# EAGLE schematic AIO (EAGLE 6.4)
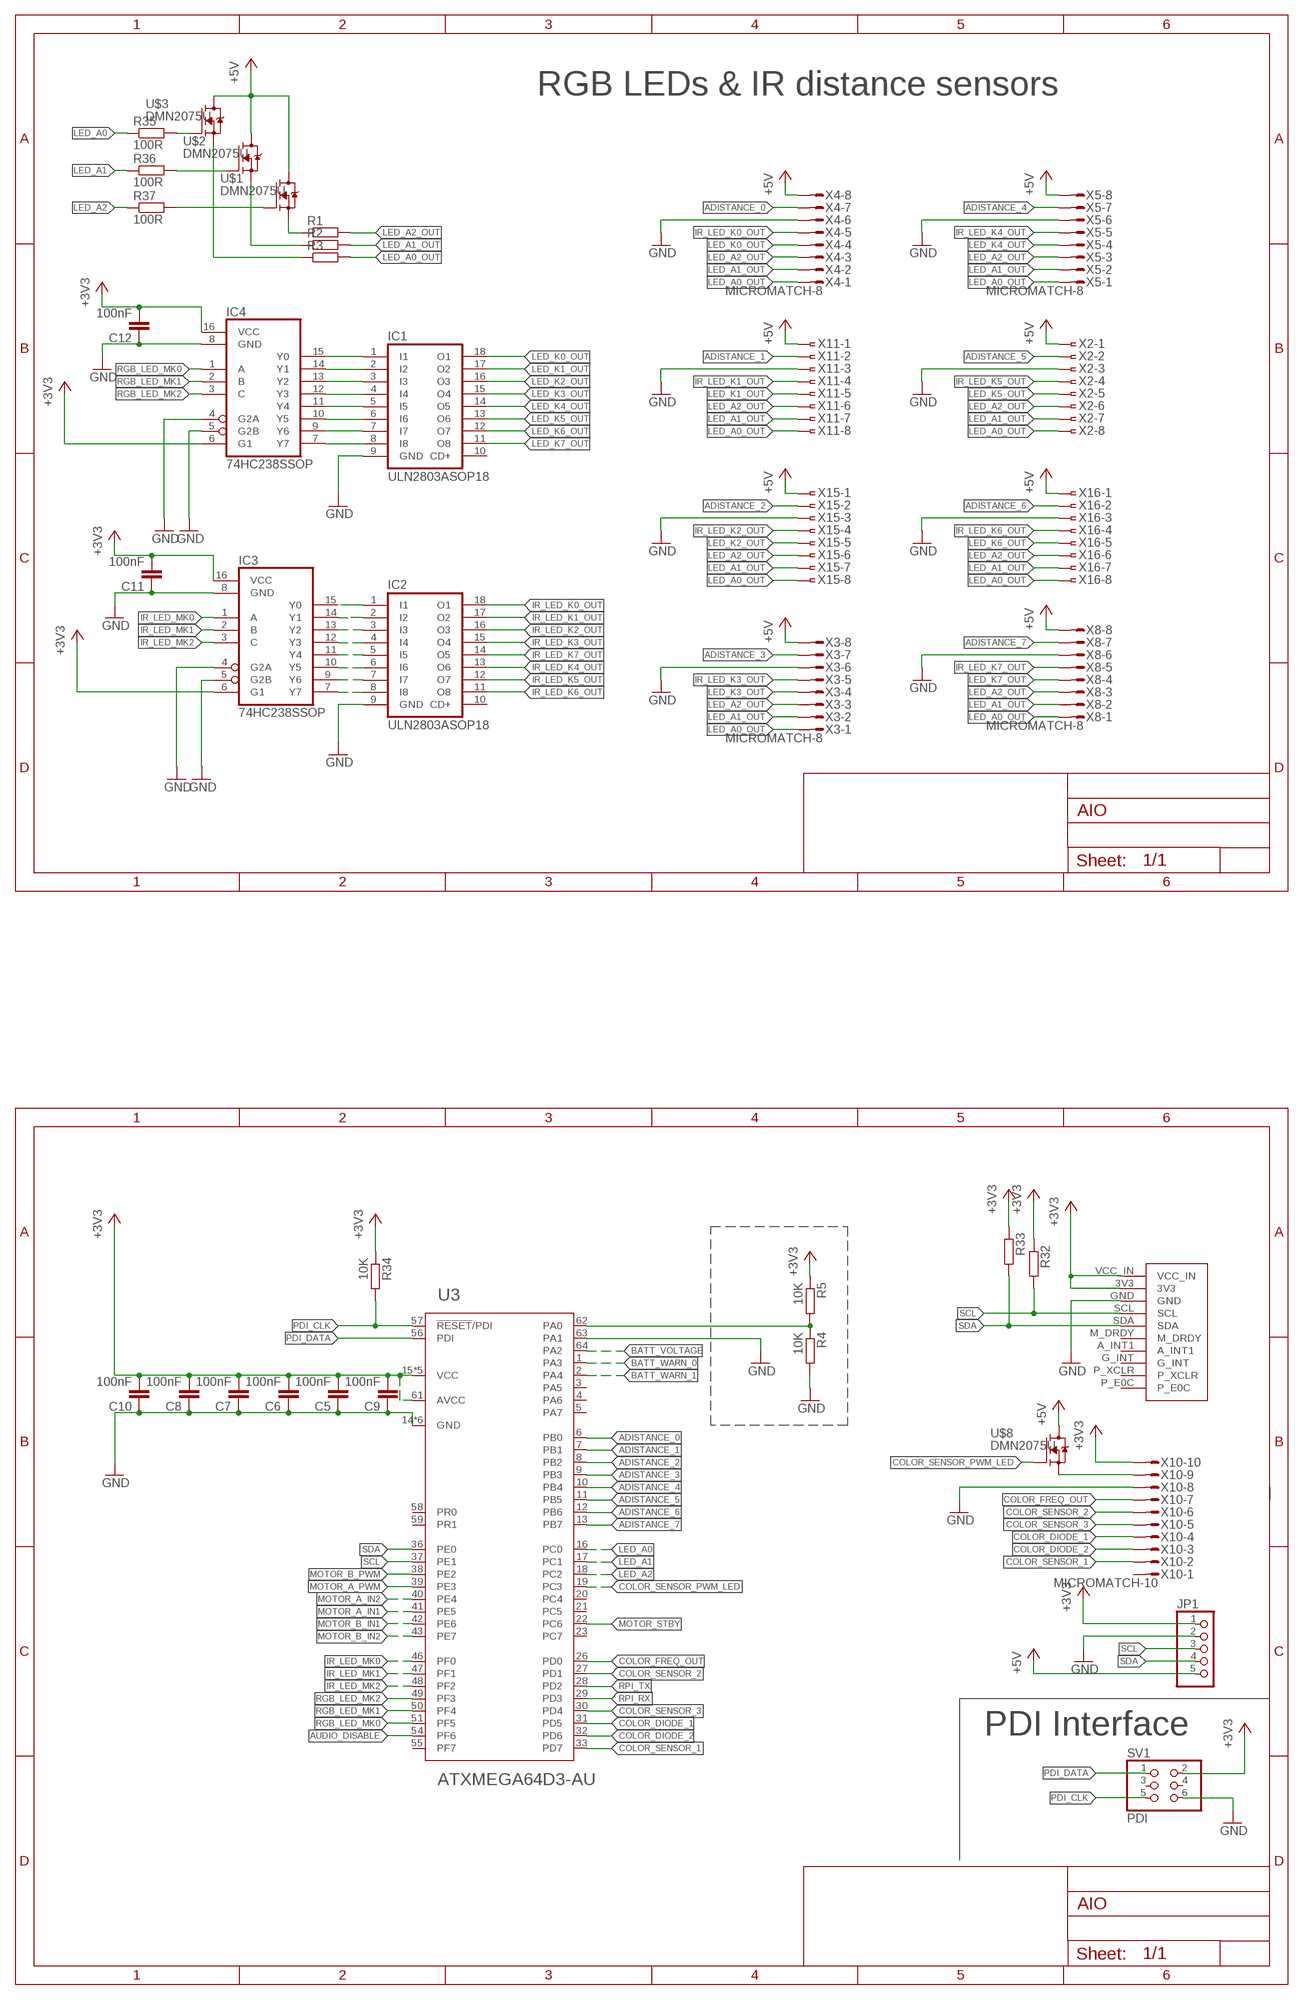
[diagram p0: schematic, sheet 1, part 1 of 2]
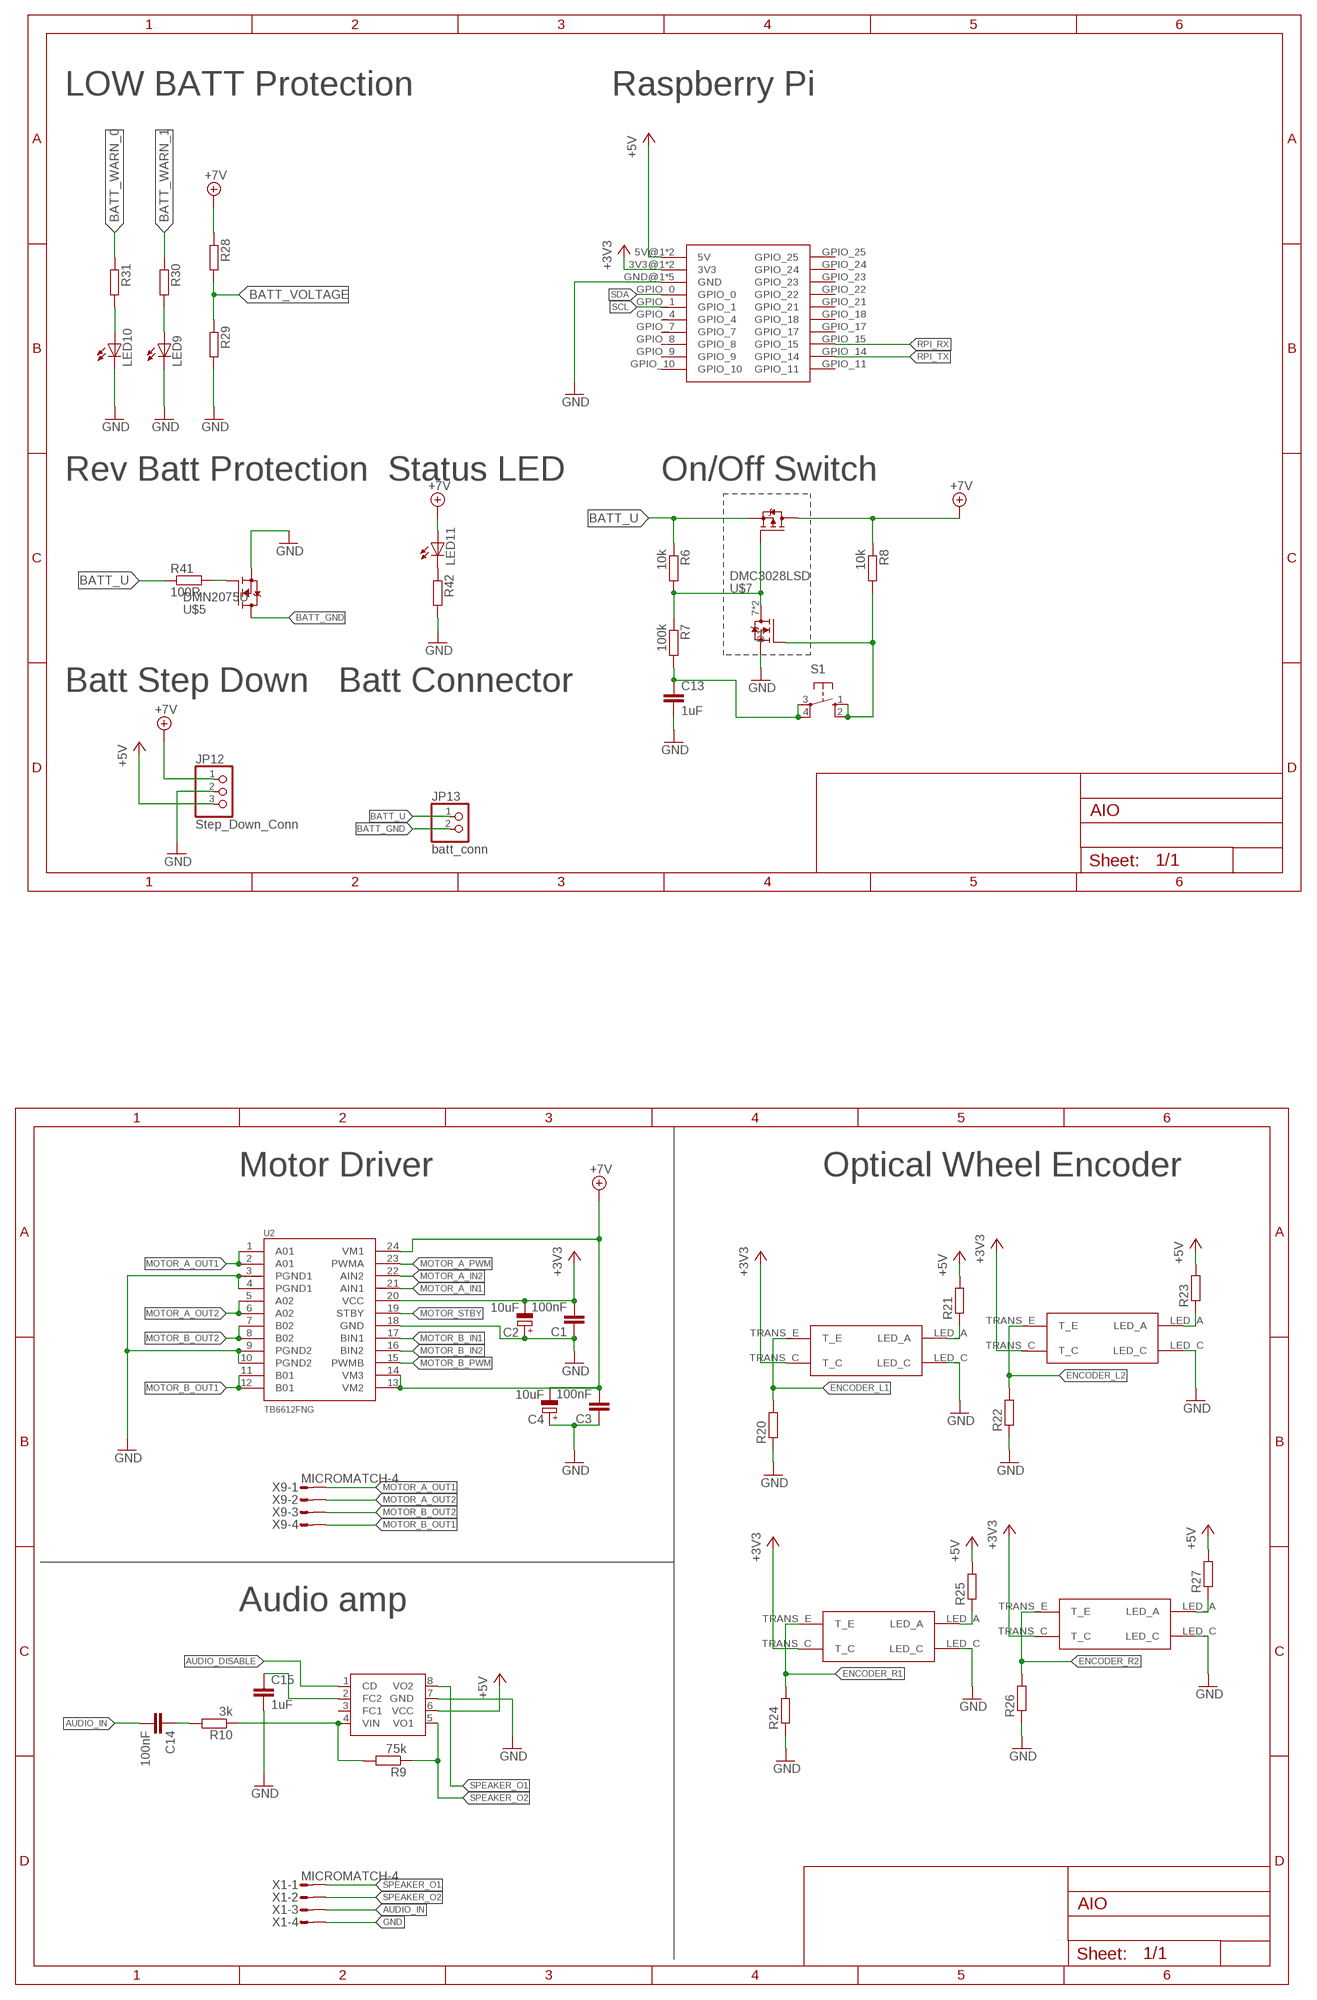
[diagram p1: schematic, sheet 1, part 2 of 2]

## Parts
C1  100nF  C-EUC0603  [C0603]
C2  10uF  CPOL-EUSMCD  [SMC_D]
C3  100nF  C-EUC0603  [C0603]
C4  10uF  CPOL-EUSMCD  [SMC_D]
C5  100nF  C-EUC0603  [C0603]
C6  100nF  C-EUC0603  [C0603]
C7  100nF  C-EUC0603  [C0603]
C8  100nF  C-EUC0603  [C0603]
C9  100nF  C-EUC0603  [C0603]
C10  100nF  C-EUC0603  [C0603]
C11  100nF  C-EUC0603  [C0603]
C12  100nF  C-EUC0603  [C0603]
C13  1uF  C-EUC0603  [C0603]
C14  100nF  C-EUC0603  [C0603]
C15  1uF  C-EUC0603  [C0603]
IC1  ULN2803ASOP18  [SOP18]
IC2  ULN2803ASOP18  [SOP18]
IC3  74HC238SSOP  [SSOP16]
IC4  74HC238SSOP  [SSOP16]
IC5  TS34119SMD  [SO08]
JP1  PINHD-1X5  [1X05]
JP12  Step_Down_Conn  PINHD-1X3  [1X03]
JP13  batt_conn  PINHD-1X2  [1X02]
LED9  LEDCHIPLED_0603  [CHIPLED_0603]
LED10  LEDCHIPLED_0603  [CHIPLED_0603]
LED11  LEDCHIPLED_0603  [CHIPLED_0603]
R1  R-EU_R0603  [R0603]
R2  R-EU_R0603  [R0603]
R3  R-EU_R0603  [R0603]
R4  10K  R-EU_R0603  [R0603]
R5  10K  R-EU_R0603  [R0603]
R6  10k  R-EU_R0603  [R0603]
R7  100k  R-EU_R0603  [R0603]
R8  10k  R-EU_R0603  [R0603]
R9  75k  R-EU_R0603  [R0603]
R10  3k  R-EU_R0603  [R0603]
R20  R-EU_R0603  [R0603]
R21  R-EU_R0603  [R0603]
R22  R-EU_R0603  [R0603]
R23  R-EU_R0603  [R0603]
R24  R-EU_R0603  [R0603]
R25  R-EU_R0603  [R0603]
R26  R-EU_R0603  [R0603]
R27  R-EU_R0603  [R0603]
R28  R-EU_R0603  [R0603]
R29  R-EU_R0603  [R0603]
R30  R-EU_R0603  [R0603]
R31  R-EU_R0603  [R0603]
R32  R-EU_R0603  [R0603]
R33  R-EU_R0603  [R0603]
R34  10K  R-EU_R0603  [R0603]
R35  100R  R-EU_R0603  [R0603]
R36  100R  R-EU_R0603  [R0603]
R37  100R  R-EU_R0603  [R0603]
R41  100R  R-EU_R0603  [R0603]
R42  R-EU_R0603  [R0603]
S1  10-XX  [B3F-10XX]
SV1  PDI  PINHD-2X3  [2X03]
U2  TB6612FNG  TB6621FNG  [SSOP24]
U3  ATXMEGA64D3-AU  [TQFP-64A-64]
U$1  DMN2075U  [SOT95P240X112-3N]
U$2  DMN2075U  [SOT95P240X112-3N]
U$3  DMN2075U  [SOT95P240X112-3N]
U$5  DMN2075U  [SOT95P240X112-3N]
U$7  DMC3028LSD  [SO08]
U$8  DMN2075U  [SOT95P240X112-3N]
U$21  CNY70  [CNY70]
U$22  CNY70  [CNY70]
U$23  CNY70  [CNY70]
U$24  CNY70  [CNY70]
U$25  GY-81  [GY-81]
U$26  RASPBERRY-PI  [RASPERRRY-PI]
X1  MICROMATCH-4  [MICROMATCH-4]
X2  FSIDE-8  [FSIDE-8]
X3  MICROMATCH-8  [MICROMATCH-8]
X4  MICROMATCH-8  [MICROMATCH-8]
X5  MICROMATCH-8  [MICROMATCH-8]
X8  MICROMATCH-8  [MICROMATCH-8]
X9  MICROMATCH-4  [MICROMATCH-4]
X10  MICROMATCH-10  [MICROMATCH-10]
X11  FSIDE-8  [FSIDE-8]
X15  FSIDE-8  [FSIDE-8]
X16  FSIDE-8  [FSIDE-8]

## Nets
+3V3: C1.2 C2.- C5.2 C6.2 C7.2 C8.2 C9.2 C10.2 C11.2 C12.2 IC3.6(G1) IC3.16(VCC) IC4.6(G1) IC4.16(VCC) JP1.1 R5.1 R32.1 R33.1 R34.1 SV1.2 U2.20(VCC) U3.15(VCC) U3.25(VCC) U3.35(VCC) U3.45(VCC) U3.53(VCC) U3.61(AVCC) U$21.TRANS_C(T_C) U$22.TRANS_C(T_C) U$23.TRANS_C(T_C) U$24.TRANS_C(T_C) U$25.3V3 U$25.VCC_IN U$26.3V3@1(3V3) U$26.3V3@2(3V3) X10.10
+5V: IC5.6(VCC) JP1.5 JP12.3 R21.2 R23.2 R25.2 R27.2 U$1.D U$2.D U$3.D U$8.D U$26.5V@1(5V) U$26.5V@2(5V) X2.1 X3.8 X4.8 X5.8 X8.8 X11.1 X15.1 X16.1
+7V: C3.2 C4.- JP12.1 LED11.A R8.1 R28.1 U2.13(VM2) U2.14(VM3) U2.24(VM1) U$7.5(D2) U$7.6(D2)
ADISTANCE_0: U3.6(PB0) X4.7
ADISTANCE_1: U3.7(PB1) X11.2
ADISTANCE_2: U3.8(PB2) X15.2
ADISTANCE_3: U3.9(PB3) X3.7
ADISTANCE_4: U3.10(PB4) X5.7
ADISTANCE_5: U3.11(PB5) X2.2
ADISTANCE_6: U3.12(PB6) X16.2
ADISTANCE_7: U3.13(PB7) X8.7
AUDIO_DISABLE: IC5.1(CD) U3.54(PF6)
AUDIO_IN: C14.2 X1.3
BATT_GND: JP13.2 U$5.D
BATT_U: JP13.1 R6.1 R41.1 U$7.3(S2)
BATT_VOLTAGE: R28.2 R29.1 U3.64(PA2)
BATT_WARN_0: R31.1 U3.1(PA3)
BATT_WARN_1: R30.1 U3.2(PA4)
COLOR_DIODE_1: U3.31(PD5) X10.4
COLOR_DIODE_2: U3.32(PD6) X10.3
COLOR_FREQ_OUT: U3.26(PD0) X10.7
COLOR_SENSOR_1: U3.33(PD7) X10.2
COLOR_SENSOR_2: U3.27(PD1) X10.6
COLOR_SENSOR_3: U3.30(PD4) X10.5
COLOR_SENSOR_PWM_LED: U3.19(PC3) U$8.G
ENCODER_L1: R20.2 U$21.TRANS_E(T_E)
ENCODER_L2: R22.2 U$22.TRANS_E(T_E)
ENCODER_R1: R24.2 U$23.TRANS_E(T_E)
ENCODER_R2: R26.2 U$24.TRANS_E(T_E)
GND: C1.1 C2.+ C3.1 C4.+ C5.1 C6.1 C7.1 C8.1 C9.1 C10.1 C11.1 C12.1 C13.2 C15.2 IC1.9(GND) IC2.9(GND) IC3.4(G2A) IC3.5(G2B) IC3.8(GND) IC4.4(G2A) IC4.5(G2B) IC4.8(GND) IC5.7(GND) JP1.2 JP12.2 LED9.C LED10.C R4.2 R20.1 R22.1 R24.1 R26.1 R29.2 R42.2 SV1.6 U2.3(PGND1) U2.4(PGND1) U2.9(PGND2) U2.10(PGND2) U2.18(GND) U3.14(GND) U3.24(GND) U3.34(GND) U3.44(GND) U3.52(GND) U3.60(GND) U3.63(PA1) U$5.S U$7.1(S1) U$21.LED_C U$22.LED_C U$23.LED_C U$24.LED_C U$25.GND U$26.GND@1(GND) U$26.GND@2(GND) U$26.GND@3(GND) U$26.GND@4(GND) U$26.GND@5(GND) X1.4 X2.3 X3.6 X4.6 X5.6 X8.6 X10.8 X11.3 X15.3 X16.3
IR_LED_K0: IC2.1(I1) IC3.15(Y0)
IR_LED_K0_OUT: IC2.18(O1) X4.5
IR_LED_K1: IC2.2(I2) IC3.14(Y1)
IR_LED_K1_OUT: IC2.17(O2) X11.4
IR_LED_K2_OUT: IC2.16(O3) X15.4
IR_LED_K3_OUT: IC2.15(O4) X3.5
IR_LED_K4_OUT: IC2.13(O6) X5.5
IR_LED_K5_OUT: IC2.12(O7) X2.4
IR_LED_K6_OUT: IC2.11(O8) X16.4
IR_LED_K7_OUT: IC2.14(O5) X8.5
IR_LED_MK0: IC3.1(A) U3.46(PF0)
IR_LED_MK1: IC3.2(B) U3.47(PF1)
IR_LED_MK2: IC3.3(C) U3.48(PF2)
LED_A0: R35.1 U3.16(PC0)
LED_A0_OUT: R3.2 X2.8 X3.1 X4.1 X5.1 X8.1 X11.8 X15.8 X16.8
LED_A1: R36.1 U3.17(PC1)
LED_A1_OUT: R2.2 X2.7 X3.2 X4.2 X5.2 X8.2 X11.7 X15.7 X16.7
LED_A2: R37.1 U3.18(PC2)
LED_A2_OUT: R1.2 X2.6 X3.3 X4.3 X5.3 X8.3 X11.6 X15.6 X16.6
LED_K0_OUT: IC1.18(O1) X4.4
LED_K1_OUT: IC1.17(O2) X11.5
LED_K2_OUT: IC1.16(O3) X15.5
LED_K3_OUT: IC1.15(O4) X3.4
LED_K4_OUT: IC1.14(O5) X5.4
LED_K5_OUT: IC1.13(O6) X2.5
LED_K6_OUT: IC1.12(O7) X16.5
LED_K7_OUT: IC1.11(O8) X8.4
MOTOR_A_IN1: U2.21(AIN1) U3.41(PE5)
MOTOR_A_IN2: U2.22(AIN2) U3.40(PE4)
MOTOR_A_OUT1: U2.1(A01) U2.2(A01) X9.1
MOTOR_A_OUT2: U2.5(A02) U2.6(A02) X9.2
MOTOR_A_PWM: U2.23(PWMA) U3.39(PE3)
MOTOR_B_IN1: U2.17(BIN1) U3.42(PE6)
MOTOR_B_IN2: U2.16(BIN2) U3.43(PE7)
MOTOR_B_OUT1: U2.11(B01) U2.12(B01) X9.4
MOTOR_B_OUT2: U2.7(B02) U2.8(B02) X9.3
MOTOR_B_PWM: U2.15(PWMB) U3.38(PE2)
MOTOR_STBY: U2.19(STBY) U3.22(PC6)
N$1: R1.1 U$1.S
N$2: R2.1 U$2.S
N$3: R3.1 U$3.S
N$4: R4.1 R5.2 U3.62(PA0)
N$5: U$8.S X10.9
N$6: IC2.3(I3) IC3.13(Y2)
N$7: IC2.4(I4) IC3.12(Y3)
N$8: R41.2 U$5.G
N$9: IC2.5(I5) IC3.11(Y4)
N$10: IC2.6(I6) IC3.10(Y5)
N$11: R23.1 U$22.LED_A
N$12: IC2.7(I7) IC3.9(Y6)
N$13: IC2.8(I8) IC3.7(Y7)
N$15: IC5.4(VIN) R9.2 R10.1
N$16: C13.1 R7.2 S1.3(P) S1.4(P1)
N$17: C14.1 R10.2
N$18: R8.2 S1.1(S) S1.2(S1) U$7.2(G1)
N$19: LED11.C R42.1
N$20: R25.1 U$23.LED_A
N$21: IC1.1(I1) IC4.15(Y0)
N$22: R6.2 R7.1 U$7.4(G2) U$7.7(D1) U$7.8(D1)
N$23: R21.1 U$21.LED_A
N$24: IC1.2(I2) IC4.14(Y1)
N$26: R27.1 U$24.LED_A
N$27: IC1.3(I3) IC4.13(Y2)
N$28: IC1.4(I4) IC4.12(Y3)
N$29: LED9.A R30.2
N$30: IC1.5(I5) IC4.11(Y4)
N$31: IC1.6(I6) IC4.10(Y5)
N$32: LED10.A R31.2
N$33: IC1.7(I7) IC4.9(Y6)
N$34: IC1.8(I8) IC4.7(Y7)
N$36: C15.1 IC5.2(FC2)
N$38: R35.2 U$3.G
N$39: R36.2 U$2.G
N$40: R37.2 U$1.G
PDI_CLK: R34.2 SV1.5 U3.57(!RESET!/PDI)
PDI_DATA: SV1.1 U3.56(PDI)
RGB_LED_MK0: IC4.1(A) U3.51(PF5)
RGB_LED_MK1: IC4.2(B) U3.50(PF4)
RGB_LED_MK2: IC4.3(C) U3.49(PF3)
RPI_RX: U3.29(PD3) U$26.GPIO_15
RPI_TX: U3.28(PD2) U$26.GPIO_14
SCL: JP1.3 R32.2 U3.37(PE1) U$25.SCL U$26.GPIO_1
SDA: JP1.4 R33.2 U3.36(PE0) U$25.SDA U$26.GPIO_0
SPEAKER_O1: IC5.8(VO2) X1.1
SPEAKER_O2: IC5.5(VO1) R9.1 X1.2
Unconnected: IC1.10(CD+) IC2.10(CD+) IC5.3(FC1) SV1.3 SV1.4 U3.3(PA5) U3.4(PA6) U3.5(PA7) U3.20(PC4) U3.21(PC5) U3.23(PC7) U3.55(PF7) U3.58(PR0) U3.59(PR1) U$25.A_INT1 U$25.G_INT U$25.M_DRDY U$25.P_E0C U$25.P_XCLR U$26.GPIO_4 U$26.GPIO_7 U$26.GPIO_8 U$26.GPIO_9 U$26.GPIO_10 U$26.GPIO_11 U$26.GPIO_17 U$26.GPIO_18 U$26.GPIO_21 U$26.GPIO_22 U$26.GPIO_23 U$26.GPIO_24 U$26.GPIO_25 X10.1

## Notes on the sheet
- RGB LEDs & IR distance sensors | LOW BATT Protection | Raspberry Pi
- Rev Batt Protection | Status LED | On/Off Switch
- Batt Step Down | Batt Connector
- Motor Driver | Optical Wheel Encoder
- Audio amp
- PDI Interface

## Library data of the parts
C1 C3 C5-C15 = rcl:C-EU: CAPACITOR, European symbol
C2 C4 = rcl:CPOL-EU: POLARIZED CAPACITOR, European symbol
IC1 IC2 = BEEP:ULN2803A: DRIVER ARRAY
IC3 IC4 = BEEP:74HC238: 3 to 8 line DECODER/DEMULTIPLEXER
IC5 = BEEP:TS34119
JP1 = pinhead:PINHD-1X5: PIN HEADER
JP12 = pinhead:PINHD-1X3: PIN HEADER
JP13 = pinhead:PINHD-1X2: PIN HEADER
LED9-LED11 = led:LED: LED OSRAM: - CHIPLED LG R971, LG N971, LY N971, LG Q971, LY Q971, LO R971, LY R971 LH N974, LH R974 LS Q976, LO Q976, LY Q976 LO Q996 - Hyper CHIPLED LW Q18S LB Q993, LB Q99A, LB R99A - SideLED LS A670, LO A670, LY A670, LG A670, LP A670 LB A673, LV A673, LT A673, LW A673 LH A674 LY A675 LS A676, LA A676, LO A676, LY A676, LW A676 LS A679, LY A679, LG A679 - Hyper Micro SIDELED® LS Y876, LA Y876, LO Y876, LY Y876 LT Y87S - SmartLED LW L88C, LW L88S LB L89C, LB L89S, LG L890 LS L89K, LO L89K, LY L89K LS L896, LA L896, LO L896, LY L896 - TOPLED LS T670, LO T670, LY T670, LG T670, LP T670 LSG T670, LSP T670, LSY T670, LOP T670, LYG T670 LG T671, LOG T671, LSG T671 LB T673, LV T673, LT T673, LW T673 LH T674 LS T676, LA T676, LO T676, LY T676, LB T676, LH T676, LSB T676, LW T676 LB T67C, LV T67C, LT T67C, LS T67K, LO T67K, LY T67K, LW E67C LS E67B, LA E67B, LO E67B, LY E67B, LB E67C, LV E67C, LT E67C LW T67C LS T679, LY T679, LG T679 LS T770, LO T770, LY T770, LG T770, LP T770 LB T773, LV T773, LT T773, LW T773 LH T774 LS E675, LA E675, LY E675, LS T675 LS T776, LA T776, LO T776, LY T776, LB T776 LHGB T686 LT T68C, LB T68C - Hyper Mini TOPLED® LB M676 - Mini TOPLED Santana® LG M470 LS M47K, LO M47K, LY M47K Source: http://www.osram.convergy.de LUXEON: - LUMILED® LXK2-PW12-R00, LXK2-PW12-S00, LXK2-PW14-U00, LXK2-PW14-V00 LXK2-PM12-R00, LXK2-PM12-S00, LXK2-PM14-U00 LXK2-PE12-Q00, LXK2-PE12-R00, LXK2-PE12-S00, LXK2-PE14-T00, LXK2-PE14-U00 LXK2-PB12-K00, LXK2-PB12-L00, LXK2-PB12-M00, LXK2-PB14-N00, LXK2-PB14-P00, LXK2-PB14-Q00 LXK2-PR12-L00, LXK2-PR12-M00, LXK2-PR14-Q00, LXK2-PR14-R00 LXK2-PD12-Q00, LXK2-PD12-R00, LXK2-PD12-S00 LXK2-PH12-R00, LXK2-PH12-S00 LXK2-PL12-P00, LXK2-PL12-Q00, LXK2-PL12-R00 Source: www.luxeon.com KINGBRIGHT: KA-3528ASYC Source: www.kingbright.com
R1-R10 R20-R37 R41 R42 = rcl:R-EU_: RESISTOR, European symbol
S1 = switch-omron:10-XX: OMRON SWITCH; MPN: B3F-1000; OC_FARNELL: 176432; OC_NEWARK: 36M3542
SV1 = pinhead:PINHD-2X3: PIN HEADER
U2 = SparkFun-PowerIC:TB6621FNG: Toshiba 1A dual motor driver IC-09363; PROD_ID: IC-09363
U3 = atmel-xmega:ATXMEGA64D3: 8/16-bit XMEGA C3 Microcontroller Features High-performance, Low-power 8/16-bit Atmel® AVR® XMEGATM Microcontroller Non-volatile Program and Data Memories – 64K - 256K Bytes of In-System Self-Programmable Flash – 4K - 8K Bytes Boot Code Section with Independent Lock Bits – 2K - 4K Bytes EEPROM – 4K - 16K Bytes Internal SRAM Peripheral Features – Four-channel Event System – Five 16-bit Timer/Counters Four Timer/Counters with 4 Output Compare or Input Capture channels One Timer/Counters with 2 Output Compare or Input Capture channels High Resolution Extensions on two Timer/Counters Advanced Waveform Extension on one Timer/Counter – Three USARTs IrDA Extension on 1 USART – Two Two-Wire Interfaces with dual address match(I2C and SMBus compatible) – Two SPI (Serial Peripheral Interfaces) – 16-bit Real Time Counter with Separate Oscillator – One Sixteen-channel, 12-bit, 200ksps Analog to Digital Converter – Two Analog Comparators with Window compare function – External Interrupts on all General Purpose I/O pins – Programmable Watchdog Timer with Separate On-chip Ultra Low Power Oscillator Special Microcontroller Features – Power-on Reset and Programmable Brown-out Detection – Internal and External Clock Options with PLL – Programmable Multi-level Interrupt Controller – Sleep Modes: Idle, Power-down, Standby, Power-save, Extended Standby – Advanced Programming, Test and Debugging Interface PDI (Program and Debug Interface) for programming, test and debugging I/O and Packages – 50 Programmable I/O Lines – 64-lead TQFP – 64-pad QFN Operating Voltage – 1.6 – 3.6V Speed performance – 0 – 12 MHz @ 1.6 – 3.6V – 0 – 32 MHz @ 2.7 – 3.6V
U$1-U$3 U$5 U$8 = BEEP:DMN2075U
U$7 = BEEP:DMC3028LSD
U$21-U$24 = BEEP:CNY70
U$25 = BEEP:GY-81
U$26 = BEEP:RASPBERRY-PI
X1 X9 = Con-amp-micromatch:MICROMATCH-4: MicroMaTch 4 7-215464-4 / 0-215464-4 Drawing Number C-215464 DDEController.pdf; MPN: 7-215464-4; OC_FARNELL: 3784629; OC_NEWARK: 19R8124
X2 X11 X15 X16 = con-amp:FSIDE-8: AMP connector
X3-X5 X8 = Con-amp-micromatch:MICROMATCH-8: MicroMaTch 8 7-215464-8 / 0-215464-8 Drawing Number C-215464 DDEController.pdf; MF: FARNELL; MPN: 7-215464-8; OC_FARNELL: 3784642; OC_NEWARK: 26H0301
X10 = Con-amp-micromatch:MICROMATCH-10: MicroMaTch 10 8-215464-0 / 1-215464-0 Drawing Number C-215464 DDEController.pdf; MF: FARNELL; MPN: 8-215464-0; OC_FARNELL: 3784654; OC_NEWARK: 19J6430